# Altium schematic sheet 风扇调速DXP原理图.SchDoc
size A4
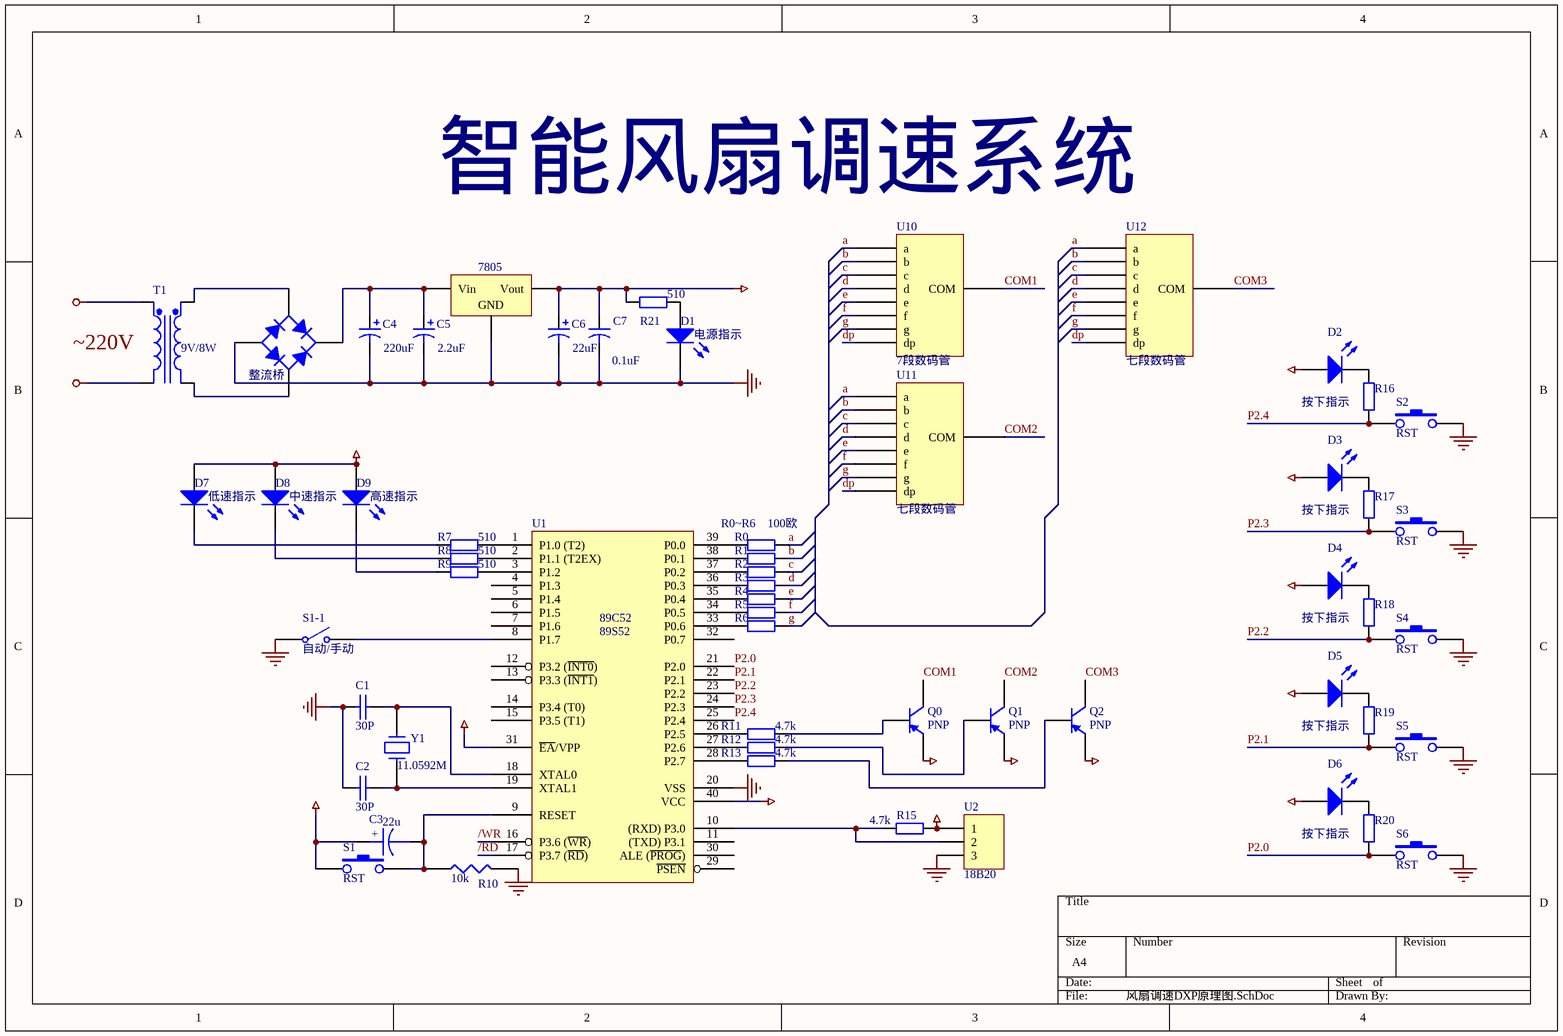
[diagram p0: 风扇调速DXP原理图.SchDoc]

## Parts
7805  (no value)  [SIP-G3/Y2]
?  整流桥  [E-BIP-P4/D10]
C1  30P
C2  30P
C3  22u
C4  value 220uF  [CC2012-0805]
C5  value 2.2uF  [CC2012-0805]
C6  value 22uF  [CC2012-0805]
C7  value 0.1uF  [CAPR5-4X5]
D1  电源指示  [DSO-F2/D6.1]
D2  按下指示  [DSO-F2/D6.1]
D3  按下指示  [DSO-F2/D6.1]
D4  按下指示  [DSO-F2/D6.1]
D5  按下指示  [DSO-F2/D6.1]
D6  按下指示  [DSO-F2/D6.1]
D7  低速指示  [DSO-F2/D6.1]
D8  中速指示  [DSO-F2/D6.1]
D9  高速指示  [DSO-F2/D6.1]
Q0  PNP  [SO-G3/C2.5]
Q1  PNP  [SO-G3/C2.5]
Q2  PNP  [SO-G3/C2.5]
R0  value R0~R6    100欧  [AXIAL-0.4]
R1  (no value)  [AXIAL-0.4]
R2  (no value)  [AXIAL-0.4]
R3  (no value)  [AXIAL-0.4]
R4  (no value)  [AXIAL-0.4]
R5  (no value)  [AXIAL-0.4]
R6  (no value)  [AXIAL-0.4]
R7  value 510  [AXIAL-0.4]
R8  value 510  [AXIAL-0.4]
R9  value 510  [AXIAL-0.4]
R10  10k
R11  value 4.7k  [AXIAL-0.4]
R12  value 4.7k  [AXIAL-0.4]
R13  value 4.7k  [AXIAL-0.4]
R15  value 4.7k  [AXIAL-0.4]
R16  (no value)  [AXIAL-0.4]
R17  (no value)  [AXIAL-0.4]
R18  (no value)  [AXIAL-0.4]
R19  (no value)  [AXIAL-0.4]
R20  (no value)  [AXIAL-0.4]
R21  value 510  [AXIAL-0.4]
S1  RST
S1-1  自动/手动  [SPST-2]
S2  RST
S3  RST
S4  RST
S5  RST
S6  RST
T1  9V/8W  [TRF_4]
U1  89S52
U2  18B20  [HDR1X3]
U10  7段数码管
U11  七段数码管
U12  七段数码管
Y1  11.0592M

## Nets
GND: 7805.2(GND) ?.1(A) C1.1 C2.1 C4.2 C5.2 C6.2 C7.2 D1.2(K) R10.2 S1-1.1(COMMON) S2.2 S3.2 S4.2 S5.2 S6.2 U1.20(VSS) U2.3
NetT1_1: T1.1(Pri+) T1.2(Pri-)
VCC: 7805.3(Vout) C3.1 C6.1 C7.1 D2.1(A) D3.1(A) D4.1(A) D5.1(A) D6.1(A) D7.1(A) D8.1(A) D9.1(A) Q0.3(E) Q1.3(E) Q2.3(E) R15.2 R21.2 S1.1 U1.31(~{EA}/VPP) U1.40(VCC) U2.1
/RD: U1.17(P3.7_(~{RD}))
/WR: U1.16(P3.6_(~{WR}))
a: R0.2 U10.?1(a) U11.?1(a) U12.?1(a)
b: R1.2 U10.?2(b) U11.?2(b) U12.?2(b)
c: R2.2 U10.?3(c) U11.?3(c) U12.?3(c)
COM1: Q0.1(C) U10.?9(COM)
COM2: Q1.1(C) U11.?9(COM)
COM3: Q2.1(C) U12.?9(COM)
d: R3.2 U10.?4(d) U11.?4(d) U12.?4(d)
dp: U10.?7(dp) U11.?7(dp) U12.?7(dp)
e: R4.2 U10.?5(e) U11.?5(e) U12.?5(e)
f: R5.2 U10.?6(f) U11.?6(f) U12.?6(f)
g: R6.2 U10.?8(g) U11.?8(g) U12.?8(g)
P2.0: R20.1 S6.1 U1.21(P2.0)
P2.1: R19.1 S5.1 U1.22(P2.1)
P2.2: R18.1 S4.1 U1.23(P2.2)
P2.3: R17.1 S3.1 U1.24(P2.3)
P2.4: R16.1 S2.1 U1.25(P2.4)
Net7805_1: 7805.1(Vin) ?.3(K) C4.1 C5.1
Net?_2: ?.2(C) T1.3(Sec+)
Net?_4: ?.4(C) T1.4(Sec-)
NetC1_2: C1.2 U1.18(XTAL0) Y1.2
NetC2_2: C2.2 U1.19(XTAL1) Y1.1
NetC3_2: C3.2 R10.1 S1.2 U1.9(RESET)
NetD1_1: D1.1(A) R21.1
NetD2_2: D2.2(K) R16.2
NetD3_2: D3.2(K) R17.2
NetD4_2: D4.2(K) R18.2
NetD5_2: D5.2(K) R19.2
NetD6_2: D6.2(K) R20.2
NetD7_2: D7.2(K) R7.1
NetD8_2: D8.2(K) R8.1
NetD9_2: D9.2(K) R9.1
NetQ0_2: Q0.2(B) R11.2
NetQ1_2: Q1.2(B) R12.2
NetQ2_2: Q2.2(B) R13.2
NetR0_1: R0.1 U1.39(P0.0)
NetR1_1: R1.1 U1.38(P0.1)
NetR2_1: R2.1 U1.37(P0.2)
NetR3_1: R3.1 U1.36(P0.3)
NetR4_1: R4.1 U1.35(P0.4)
NetR5_1: R5.1 U1.34(P0.5)
NetR6_1: R6.1 U1.33(P0.6)
NetR7_2: R7.2 U1.1(P1.0_(T2))
NetR8_2: R8.2 U1.2(P1.1_(T2EX))
NetR9_2: R9.2 U1.3(P1.2)
NetR11_1: R11.1 U1.26(P2.5)
NetR12_1: R12.1 U1.27(P2.6)
NetR13_1: R13.1 U1.28(P2.7)
NetR15_1: R15.1 U1.10((RXD)_P3.0) U2.2
NetS1-1_2: S1-1.2(NO) U1.8(P1.7)

Not connected (* = marked no-connect by the designer): U1 4(P1.3) 5(P1.4) 6(P1.5) 7(P1.6) 11((TXD)_P3.1) 12(P3.2_(~{INT0})) 13(P3.3_(~{INT1})) 14(P3.4_(T0)) 15(P3.5_(T1)) 29(~{PSEN}) 30(ALE_(~{PROG})) 32(P0.7)

## Notes on the sheet
- 智能风扇调速系统
- Labels drawn without touching a wire or pin: ~220V
- (in symbol CAPACITOR POL) +

## Library data of the parts
7805 = Volt Reg: Voltage Regulator; Published: 24-Mar-1999; LatestRevisionDate: 17-Jul-2002; LatestRevisionNote: Re-released for DXP Platform.; Publisher: Altium Limited; Code_JEDEC: SMD-220
? = Bridge1: Full Wave Diode Bridge; Published: 8-Jun-2000; LatestRevisionDate: 17-Jul-2002; LatestRevisionNote: Re-released for DXP Platform.; Publisher: Altium Limited
C1 C2 = CAP: Capacitor
C3 = CAPACITOR POL: Capacitor
C4-C6 = Cap Pol3: Polarized Capacitor (Surface Mount); Published: 8-Jun-2000; LatestRevisionDate: 17-Jul-2002; LatestRevisionNote: Re-released for DXP Platform.; PackageReference: C0805; Publisher: Altium Limited
C7 = Cap2: Capacitor; Published: 23-Sep-2002; Publisher: Altium Limited
D1-D9 = LED2: Typical RED, GREEN, YELLOW, AMBER GaAs LED; Published: 8-Jun-2000; LatestRevisionDate: 17-Jul-2002; LatestRevisionNote: Re-released for DXP Platform.; Publisher: Altium Limited
Q0-Q2 = PNP: PNP Bipolar Transistor; Published: 8-Jun-2000; LatestRevisionDate: 17-Jul-2002; LatestRevisionNote: Re-released for DXP Platform.; Publisher: Altium Limited; Code_JEDEC: SOT-23
R0 R7-R9 R11-R13 R15 R21 = Res2: Resistor; Published: 8-Jun-2000; LatestRevisionDate: 17-Jul-2002; LatestRevisionNote: Re-released for DXP Platform.; Publisher: Altium Limited
R1-R6 R16-R20 = Res2: Resistor; Value: 100; Published: 8-Jun-2000; LatestRevisionDate: 17-Jul-2002; LatestRevisionNote: Re-released for DXP Platform.; Publisher: Altium Limited
R10 = RES1
S1-S6 = SW-PB
S1-1 = SW-SPST: Single-Pole, Single-Throw Switch; Published: 24-Mar-1999; LatestRevisionDate: 17-Jul-2002; LatestRevisionNote: Re-released for DXP Platform.; Publisher: Altium Limited
T1 = Trans Cupl: Transformer (Coupled Inductor Model); Published: 8-Jun-2000; LatestRevisionDate: 17-Jul-2002; LatestRevisionNote: Re-released for DXP Platform.; Publisher: Altium Limited
U1 = 89C52
U2 = Header 3: Header, 3-Pin; LatestRevisionDate: 17-Jul-2002; LatestRevisionNote: Re-released for DXP Platform.; Publisher: Altium Limited
U10-U12 = DPY7SEG
Y1 = CRYSTAL